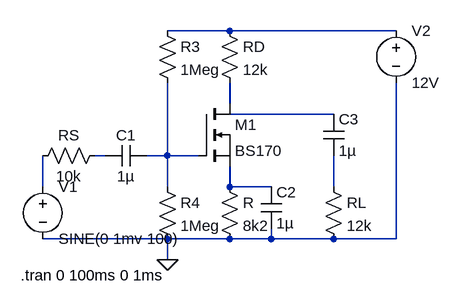
[diagram p0: schematic TP1 2018 Simulacion MOS.asc]
TP1 2018 Simulacion MOS.asc, the LTspice schematic file:
Version 4
SHEET 1 880 680
WIRE 192 16 96 16
WIRE 448 16 192 16
WIRE 192 128 192 96
WIRE 352 144 192 144
WIRE 0 208 -16 208
WIRE 96 208 96 96
WIRE 96 208 64 208
WIRE 144 208 96 208
WIRE -96 256 -96 208
WIRE 96 256 96 208
WIRE 192 256 192 224
WIRE 256 256 192 256
WIRE 352 256 352 208
WIRE 96 336 -96 336
WIRE 192 336 96 336
WIRE 256 336 256 320
WIRE 256 336 192 336
WIRE 352 336 256 336
WIRE 448 336 448 96
WIRE 448 336 352 336
WIRE 96 368 96 336
FLAG 96 368 0
SYMBOL nmos 144 128 R0
SYMATTR InstName M1
SYMATTR Value BS170
SYMBOL res 176 0 R0
SYMATTR InstName RD
SYMATTR Value 12k
SYMBOL res 176 240 R0
SYMATTR InstName R
SYMATTR Value 8k2
SYMBOL res 80 0 R0
SYMATTR InstName R3
SYMATTR Value 1Meg
SYMBOL res 80 240 R0
SYMATTR InstName R4
SYMATTR Value 1Meg
SYMBOL res 336 240 R0
SYMATTR InstName RL
SYMATTR Value 12k
SYMBOL res -112 224 R270
WINDOW 0 32 56 VTop 2
WINDOW 3 0 56 VBottom 2
SYMATTR InstName RS
SYMATTR Value 10k
SYMBOL cap 0 224 R270
WINDOW 0 32 32 VTop 2
WINDOW 3 0 32 VBottom 2
SYMATTR InstName C1
SYMATTR Value 1µ
SYMBOL voltage -96 240 R0
WINDOW 123 0 0 Left 2
WINDOW 39 0 0 Left 2
SYMATTR InstName V1
SYMATTR Value SINE(0 1mv 100)
SYMBOL cap 240 256 R0
SYMATTR InstName C2
SYMATTR Value 1µ
SYMBOL cap 336 144 R0
SYMATTR InstName C3
SYMATTR Value 1µ
SYMBOL voltage 448 0 R0
SYMATTR InstName V2
SYMATTR Value 12V
TEXT -130 392 Left 2 !.tran 0 100ms 0 1ms

The netlist it stands for:
* TP1 2018 Simulacion MOS.asc
M1 N002 N005 N007 N007 BS170
RD N001 N002 12k
R N007 0 8k2
R3 N001 N005 1Meg
R4 N005 0 1Meg
RL N008 0 12k
RS N006 N004 10k
C1 N004 N005 1µ
V1 N006 0 SINE(0 1mv 100)
C2 N007 0 1µ
C3 N003 N008 1µ
V2 N001 0 12V
.model NMOS NMOS
.model PMOS PMOS
.lib standard.mos
.tran 0 100ms 0 1ms
.backanno
.end